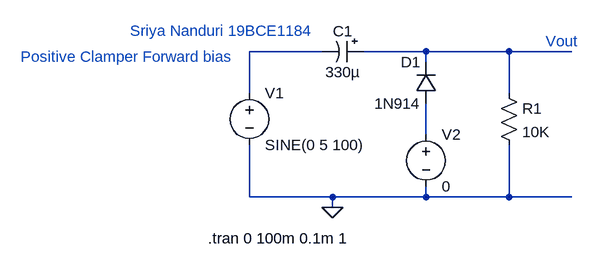
[diagram p0: schematic positive clamper forward bias.asc]
positive clamper forward bias.asc, the LTspice schematic file:
Version 4
SHEET 1 880 680
WIRE 128 64 16 64
WIRE 288 64 192 64
WIRE 416 64 288 64
WIRE 512 64 416 64
WIRE 288 80 288 64
WIRE 16 128 16 64
WIRE 416 128 416 64
WIRE 288 192 288 144
WIRE 16 288 16 208
WIRE 144 288 16 288
WIRE 288 288 288 272
WIRE 288 288 144 288
WIRE 416 288 416 208
WIRE 416 288 288 288
WIRE 512 288 416 288
WIRE 144 304 144 288
FLAG 144 304 0
SYMBOL voltage 16 112 R0
WINDOW 123 0 0 Left 0
WINDOW 39 0 0 Left 0
SYMATTR InstName V1
SYMATTR Value SINE(0 5 100)
SYMBOL voltage 288 176 R0
WINDOW 123 0 0 Left 0
WINDOW 39 0 0 Left 0
SYMATTR InstName V2
SYMATTR Value 0
SYMBOL polcap 192 48 R90
WINDOW 0 0 32 VBottom 2
WINDOW 3 32 32 VTop 2
SYMATTR InstName C1
SYMATTR Value 330µ
SYMATTR Description Capacitor
SYMATTR Type cap
SYMATTR SpiceLine V=50 Irms=1.2 Rser=0.08 Lser=0 mfg="Panasonic" pn="ECA1HFQ331" type="Al electrolytic"
SYMBOL diode 304 144 R180
WINDOW 0 24 64 Left 2
WINDOW 3 24 0 Left 2
SYMATTR InstName D1
SYMATTR Value 1N914
SYMBOL res 400 112 R0
SYMATTR InstName R1
SYMATTR Value 10K
TEXT -48 352 Left 2 !.tran 0 100m 0.1m 1
TEXT 472 48 Left 2 ;Vout
TEXT -168 32 Left 2 ;Sriya Nanduri 19BCE1184
TEXT -336 72 Left 2 ;Positive Clamper Forward bias

The netlist it stands for:
* positive clamper forward bias.asc
V1 N001 0 SINE(0 5 100)
V2 N003 0 0
C1 N002 N001 330µ V=50 Irms=1.2 Rser=0.08 Lser=0 mfg="Panasonic" pn="ECA1HFQ331" type="Al electrolytic"
D1 N003 N002 1N914
R1 N002 0 10K
.model D D
.lib standard.dio
.tran 0 100m 0.1m 1
* Vout
* Sriya Nanduri 19BCE1184
* Positive Clamper Forward bias
.backanno
.end